# EAGLE schematic PogoBoard (EAGLE 6.6.0)
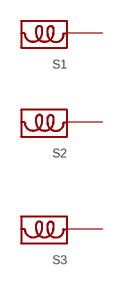
[diagram p0: schematic, sheet 1]

## Parts
S1  SPRING_PIN0861-0-15-20-82-14-11-0  [SPRING_PIN_5MM]
S2  SPRING_PIN0861-0-15-20-82-14-11-0  [SPRING_PIN_5MM]
S3  SPRING_PIN0861-0-15-20-82-14-11-0  [SPRING_PIN_5MM]
Unconnected: S1.P$1 S2.P$1 S3.P$1

## Library data of the parts
S1-S3 = dan:SPRING_PIN